# EasyEDA Pro project ProProject_RJ45_2023-11-09.epro

# Schematic RJ45
Create Date: 2023-10-20; Page Name: main; Project Name: RJ45; Schematic Name: RJ45; Update Date: 2023-10-26; Company: 嘉立创EDA; Page Size: A4; Version: V1.0
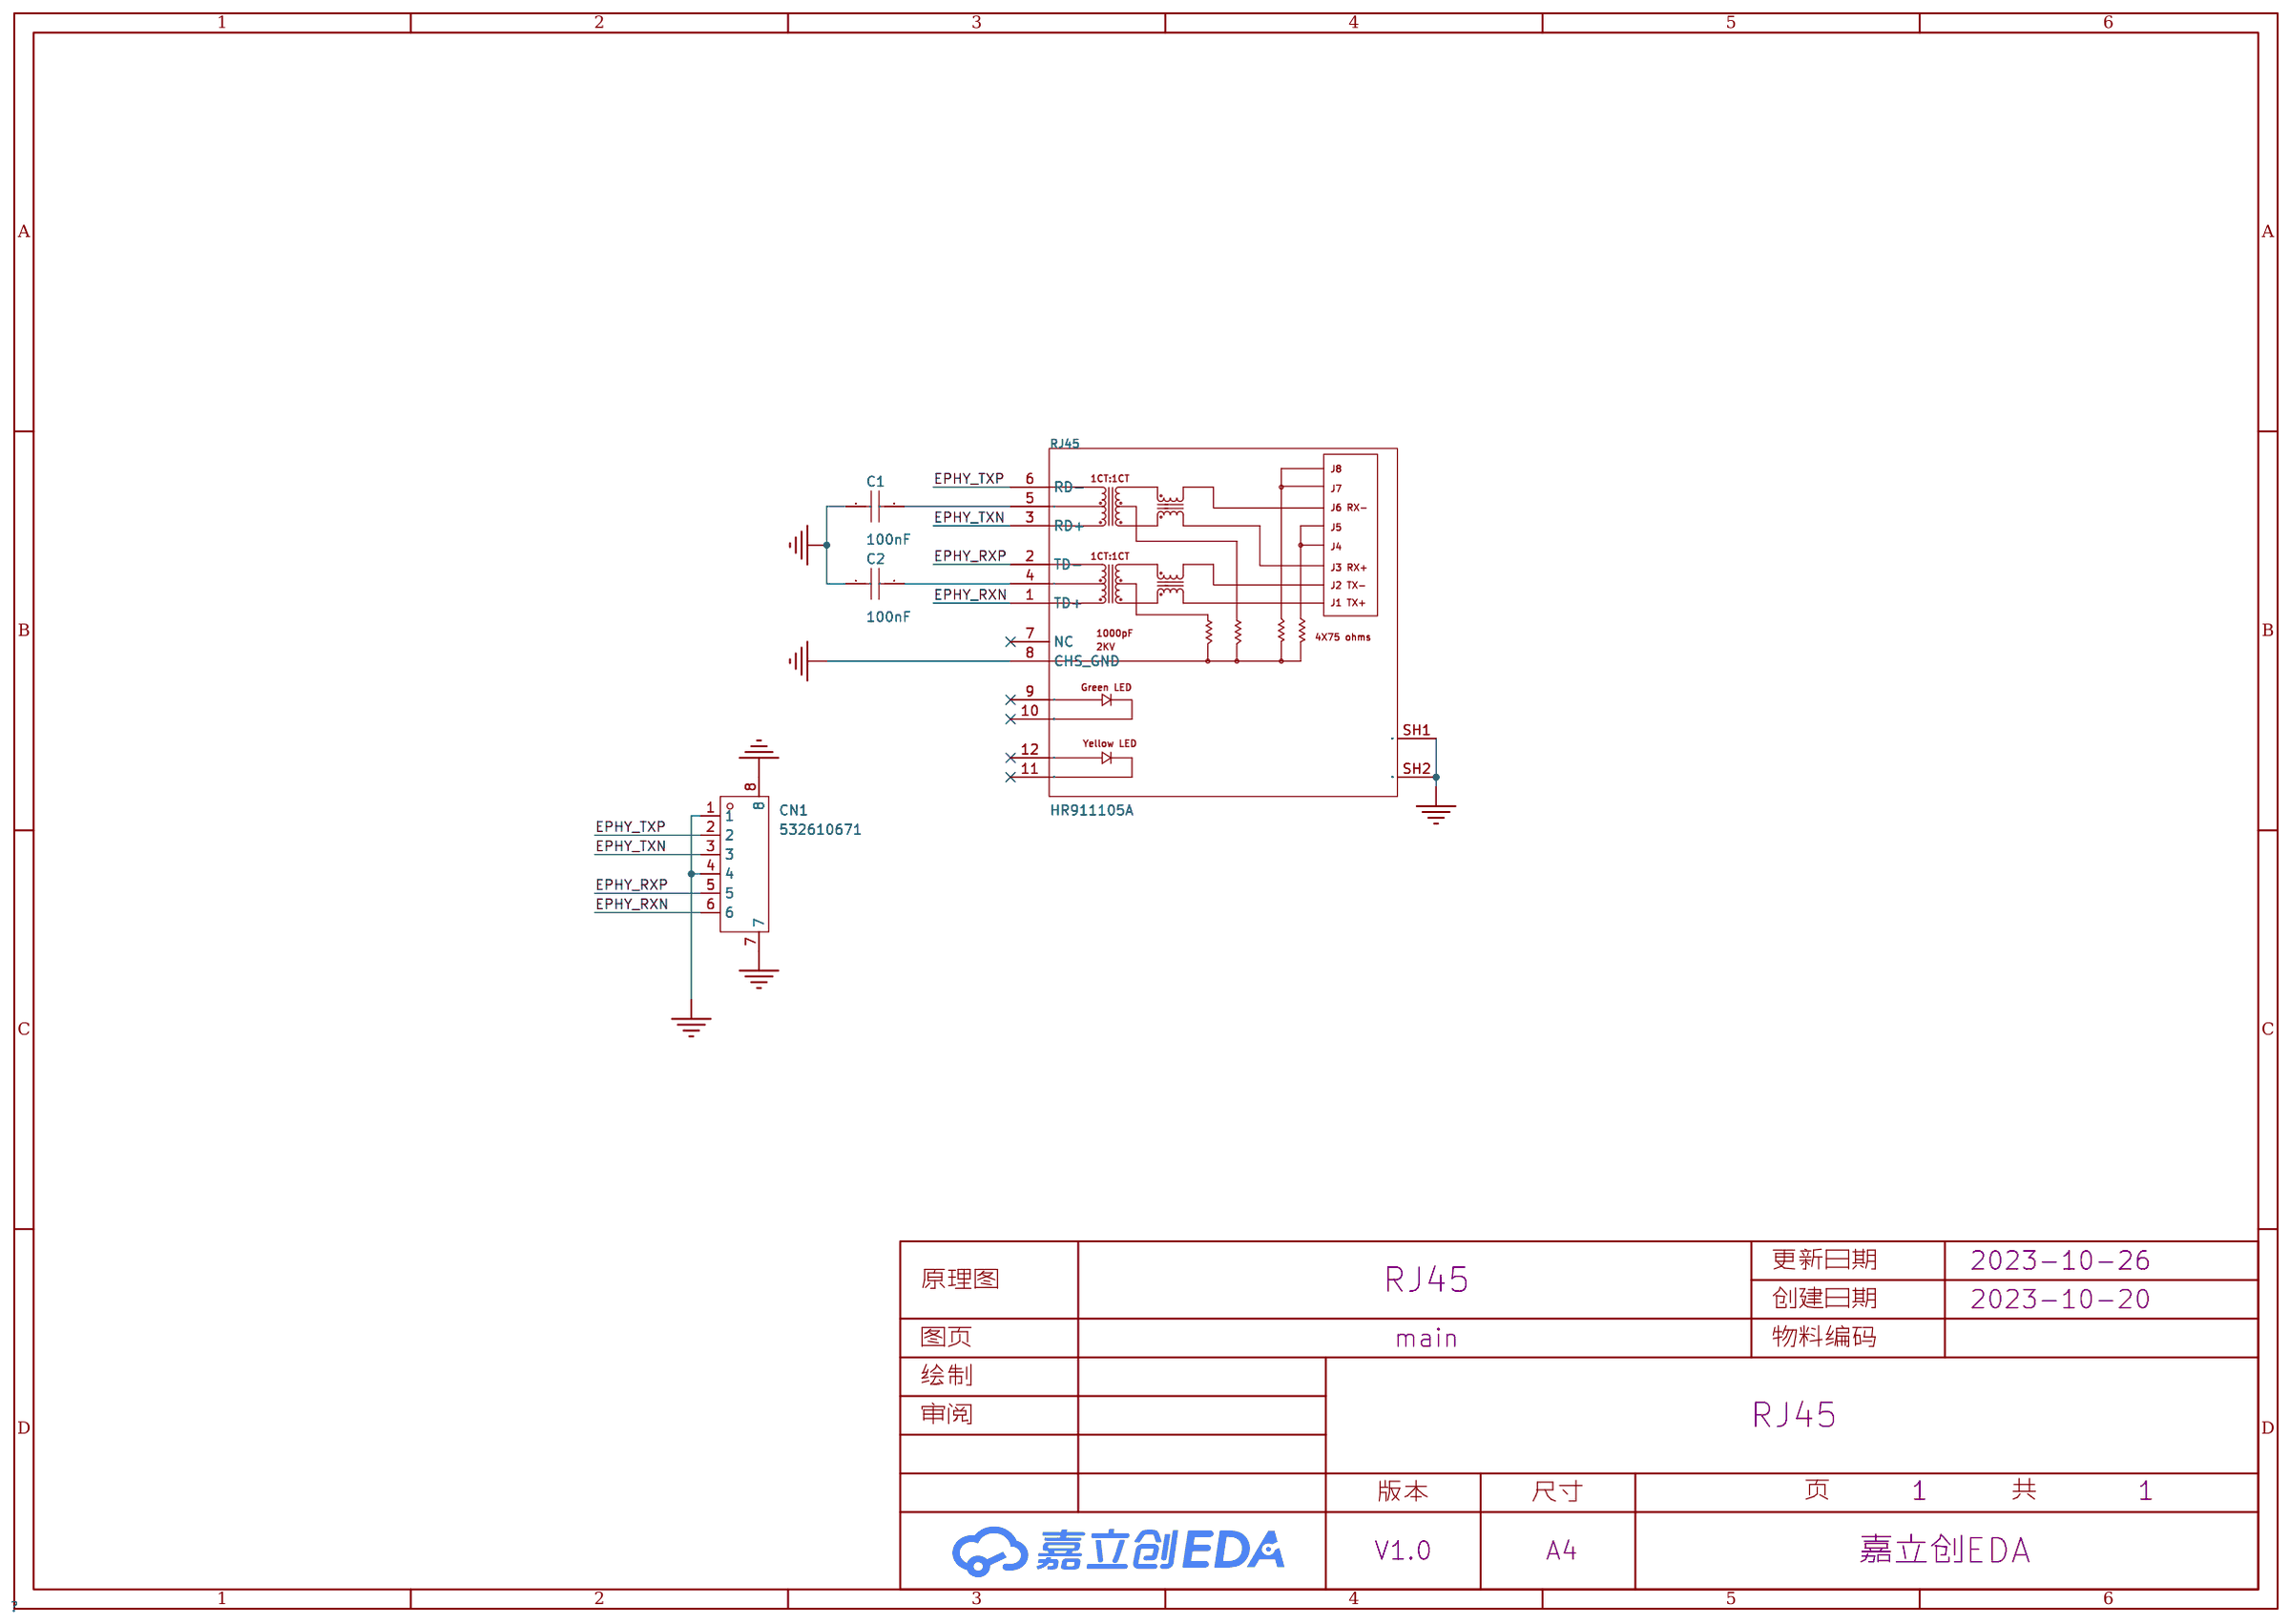
[diagram p0: schematic sheet]

## Parts
C1  100nF  [C0402]
C2  100nF  [C0402]
CN1  532610671  [CONN-SMD_6P-P1.25_53261-0671]
RJ45  HR911105A  [RJ45-TH_HR911105A]

## Library data of the parts
C1 C2 = CL05B104KO5NNNC: 容值:100nF;精度:±10%;额定电压:16V;材质(温度系数):X7R;; LCSC Part Name: 100nF ±10% 16V; Supplier Part: C1525; Manufacturer: SAMSUNG(三星); Supplier Footprint: 0402; JLCPCB Part Class: Basic Part; Datasheet: https://atta.szlcsc.com/upload/public/pdf/source/20160103/1457707674891.pdf; Supplier: LCSC; Tolerance: ±10%; Voltage Rated: 16V; Temperature Coefficient: X7R
CN1 = 532610671: 参考系列:-;间距:1.25mm;插针结构:1x6P;排数:1;每排PIN数:6;行距:-;安装方式:-;触头材质:青铜;; LCSC Part Name: 1.25mm 1x6P; Supplier Part: C99277; Manufacturer: MOLEX; JLCPCB Part Class: 扩展库; Datasheet: https://atta.szlcsc.com/upload/public/pdf/source/20180713/C99277_7A4A98FEF11A2209B5FFC17F14BF7E54.pdf; Supplier: LCSC; Pitch: 1.25mm; Pins Structure: 1x6P; Number of Rows: 1; Number of PINs Per Row: 6; Contact Material: 青铜
RJ45 = HR911105A_C12074: 连接器类型:RJ插座;USOC代码:RJ45;端口数量:1;等级:-;屏蔽:-;LED:带LED;; LCSC Part Name: RJ45 带LED 带LED灯; Supplier Part: C12074; Manufacturer: HANRUN(汉仁); Supplier Footprint: 插件; JLCPCB Part Class: 扩展库; Datasheet: https://atta.szlcsc.com/upload/public/pdf/source/20170918/C12074_1505726819496976146.pdf; Supplier: LCSC; Connector Type: RJ插座; Number of Ports: 1; LED: 带LED

## Nets
GND: C1.1 C2.1 CN1.1 CN1.4 CN1.7 CN1.8 RJ45.8(CHS GND) RJ45.SH1 RJ45.SH2
EPHY_RXN: CN1.6 RJ45.1(TD+)
EPHY_RXP: CN1.5 RJ45.2(TD-)
EPHY_TXN: CN1.3 RJ45.3(RD+)
EPHY_TXP: CN1.2 RJ45.6(RD-)
$1N607: C1.2 RJ45.5
$1N610: C2.2 RJ45.4

Not connected (* = marked no-connect by the designer): RJ45 7(NC)* 9* 10* 11* 12*

# Board RJ45
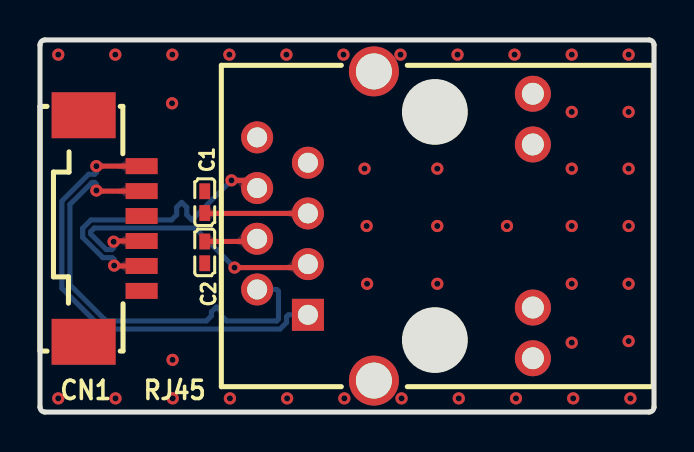
[diagram p1: board, top side]
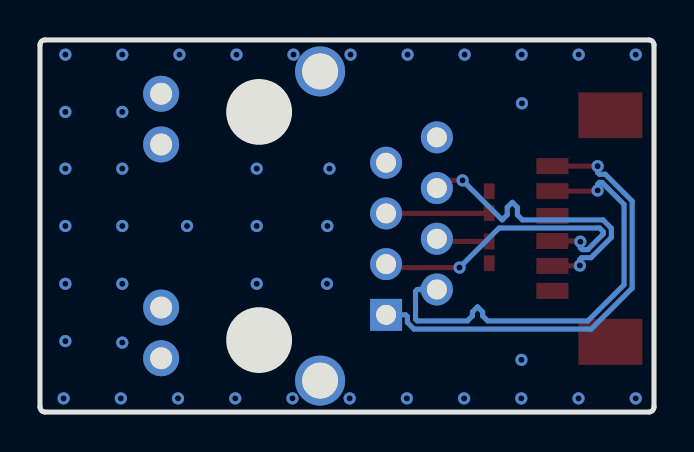
[diagram p2: board, bottom side, seen from below]

Outline 30.71 x 18.64 mm; copper layers: Top Layer, Bottom Layer. Coordinates in mm from the lower left corner of the outline.
Outline path: 0,18.39 0,0.25 arc(0.07,0.07) 0.25,0 30.45,0 arc(30.63,0.07) 30.71,0.25 30.71,18.39 arc(30.63,18.57) 30.45,18.64 0.25,18.64 arc(0.07,18.57) 0,18.39
Stack: Top Layer 0.035mm / Dielectric1 1.51mm FR4 er 4.5 / Bottom Layer 0.035mm

## Design rules (mm)
net EPHY_RXN: RX
net EPHY_RXP: RX
net EPHY_TXN: TX
net EPHY_TXP: TX
template: JLCPCB Capability(Two Layers Board)
spacing copperThickness1oz (default): track to track 0.102, other pairs 0.152 to 0.3
spacing copperThickness2oz: track to track 0.203, other pairs 0.152 to 0.3
track width copperThickness1oz (default): min 0.127, default 0.254, max 2.54
track width copperThickness2oz: min 0.203, default 0.254, max 2.54
differential pair differentialPair (default): width min 0.127, default 0.254, max 2.54; gap min 0.152, default 0.152
via viaSize (default): diameter min 0.5, default 0.61, max 10; hole min 0.3, default 0.305, max 6.3

## Placement (name value [footprint] x y rotation side)
C1  100nF  [C0402]  8.24 10.52 270 top
C2  100nF  [C0402]  8.24 8 90 top
CN1  532610671  [CONN-SMD_6P-P1.25_53261-0671]  3.63 9.19 270 top
RJ45  HR911105A  [RJ45-TH_HR911105A]  17.75 9.32 90 top

## Footprints (pads in the part's own frame, mm; a bottom-side part is the same pattern mirrored in y, then rotated)
C0402
  rect 0.79x0.54 smd: 1(-0.545,0) 2(0.545,0)
CONN-SMD_6P-P1.25_53261-0671
  rect 0.8x1.6 smd: 1(3.125,1.45) 2(1.875,1.45) 3(0.625,1.45) 4(-0.625,1.45) 5(-1.875,1.45) 6(-3.125,1.45)
  rect 2.3x3.2 smd: 7(-5.675,-1.45) 8(5.675,-1.45)
RJ45-TH_HR911105A
  rect 1.6x1.6 hole 1: 1(-4.45,4.355)
  round 1.6 hole 1: 2(-3.18,6.895) 3(-1.91,4.355) 4(-0.64,6.895) 5(0.63,4.355) 6(1.9,6.895) 7(3.17,4.355) 8(4.44,6.895)
  round 1.8 hole 1.1: 9(-6.625,-6.895) 10(-4.085,-6.895) 11(4.085,-6.895) 12(6.625,-6.895)
  round 2.5 hole 1.8: SH1(-7.745,1.055) SH2(7.745,1.055)

## Nets
As in the schematic.

Pads without a net: RJ45 7 9 10 11 12

## Via types
v1: diameter 0.61, hole 0.305, Top Layer to Bottom Layer, 47 vias

## Routing (per net, layer and track width the routed paths; a pad name or vN(x,y) marks a point on that pad's centre or on a via; arc(x,y) is an arc through that point)
GND:
  vias: v1(0.91,17.91) v1(0.91,0.69) v1(3.77,17.91) v1(3.78,0.69) v1(6.62,17.91) v1(6.6,15.47) v1(6.63,2.62) v1(6.64,0.69) v1(9.47,17.91) v1(9.5,0.69) v1(12.32,17.91) v1(12.36,0.69) v1(15.18,17.91) v1(15.22,0.69) v1(16.23,12.19) v1(16.34,9.32) v1(16.36,6.43) v1(18.03,17.91) v1(18.08,0.69) v1(19.87,12.19) v1(19.87,9.32) v1(19.87,6.43) v1(20.88,17.91) v1(20.94,0.69) v1(23.35,9.32) v1(23.73,17.91) v1(23.81,0.69) v1(26.59,17.91) v1(26.59,15.04) v1(26.59,12.19) v1(26.59,9.32) v1(26.59,6.43) v1(26.59,3.48) v1(26.67,0.69) v1(29.44,17.91) v1(29.44,15.04) v1(29.44,12.19) v1(29.44,9.32) v1(29.44,6.43) v1(29.44,3.56) v1(29.53,0.69)
EPHY_RXN: length 22.9
  Top Layer w0.254: CN1.6 v1(2.82,12.32)
  Bottom Layer w0.254: RJ45.1 12.42,4.87 12.33,4.78 12.33,4.49 12,4.16 3.14,4.16 1.09,6.21 1.09,10.57 2.43,11.91 2.73,11.91 2.82,12 v1(2.82,12.32)
EPHY_RXP: length 22.9
  Top Layer w0.254: 2.9,11.1 2.93,11.07 CN1.5
  Bottom Layer w0.254: RJ45.2 11.84,6.14 11.93,6.05 11.93,4.66 11.84,4.57 9.33,4.57 9.08,4.82 9.08,5.02 8.83,5.27 8.57,5.02 8.57,4.82 8.32,4.57 3.31,4.57 1.5,6.38 1.5,10.4 2.6,11.51 2.73,11.51 2.82,11.42 v1(2.82,11.1)
EPHY_TXN: length 15.2
  Top Layer w0.254: v1(3.68,8.53) 3.72,8.57 CN1.3 ; RJ45.3 13.23,7.24 v1(9.73,7.24)
  Bottom Layer w0.254: 9.73,7.29 v1(9.73,7.24) 7.75,9.22 2.72,9.22 2.54,9.04 2.54,8.92 3.31,8.14 3.59,8.14 3.68,8.23 v1(3.68,8.53)
EPHY_TXP: length 15.2
  Top Layer w0.254: RJ45.6 10.47,11.61 v1(9.58,11.61) ; v1(3.71,7.34) 3.73,7.32 CN1.2
  Bottom Layer w0.254: v1(9.58,11.61) 7.59,9.63 7.34,9.88 7.34,10.25 7.09,10.51 6.83,10.25 6.83,9.88 6.58,9.63 2.55,9.63 2.13,9.21 2.13,8.75 3.15,7.73 3.62,7.73 3.71,7.64 v1(3.71,7.34)
$1N607: length 5.2
  Top Layer w0.254: C1.2 8.26,9.95 RJ45.5
$1N610: length 2.7
  Top Layer w0.254: RJ45.4 10.72,8.55 C2.2

## Copper pours and planes (outline as drawn; the poured copper is in the pictures)
GND on Top Layer: -0.56,19.2 31.34,19.2 31.34,-0.43 -0.56,-0.43
GND on Bottom Layer: -0.86,19.69 31.88,19.69 31.88,-0.64 -0.86,-0.64

Small or netless copper shapes (teardrops, artwork), in the pictures only: 16 on Top Layer, 7 on Bottom Layer
